# Altium schematic sheet Sheet1.SchDoc
size A4
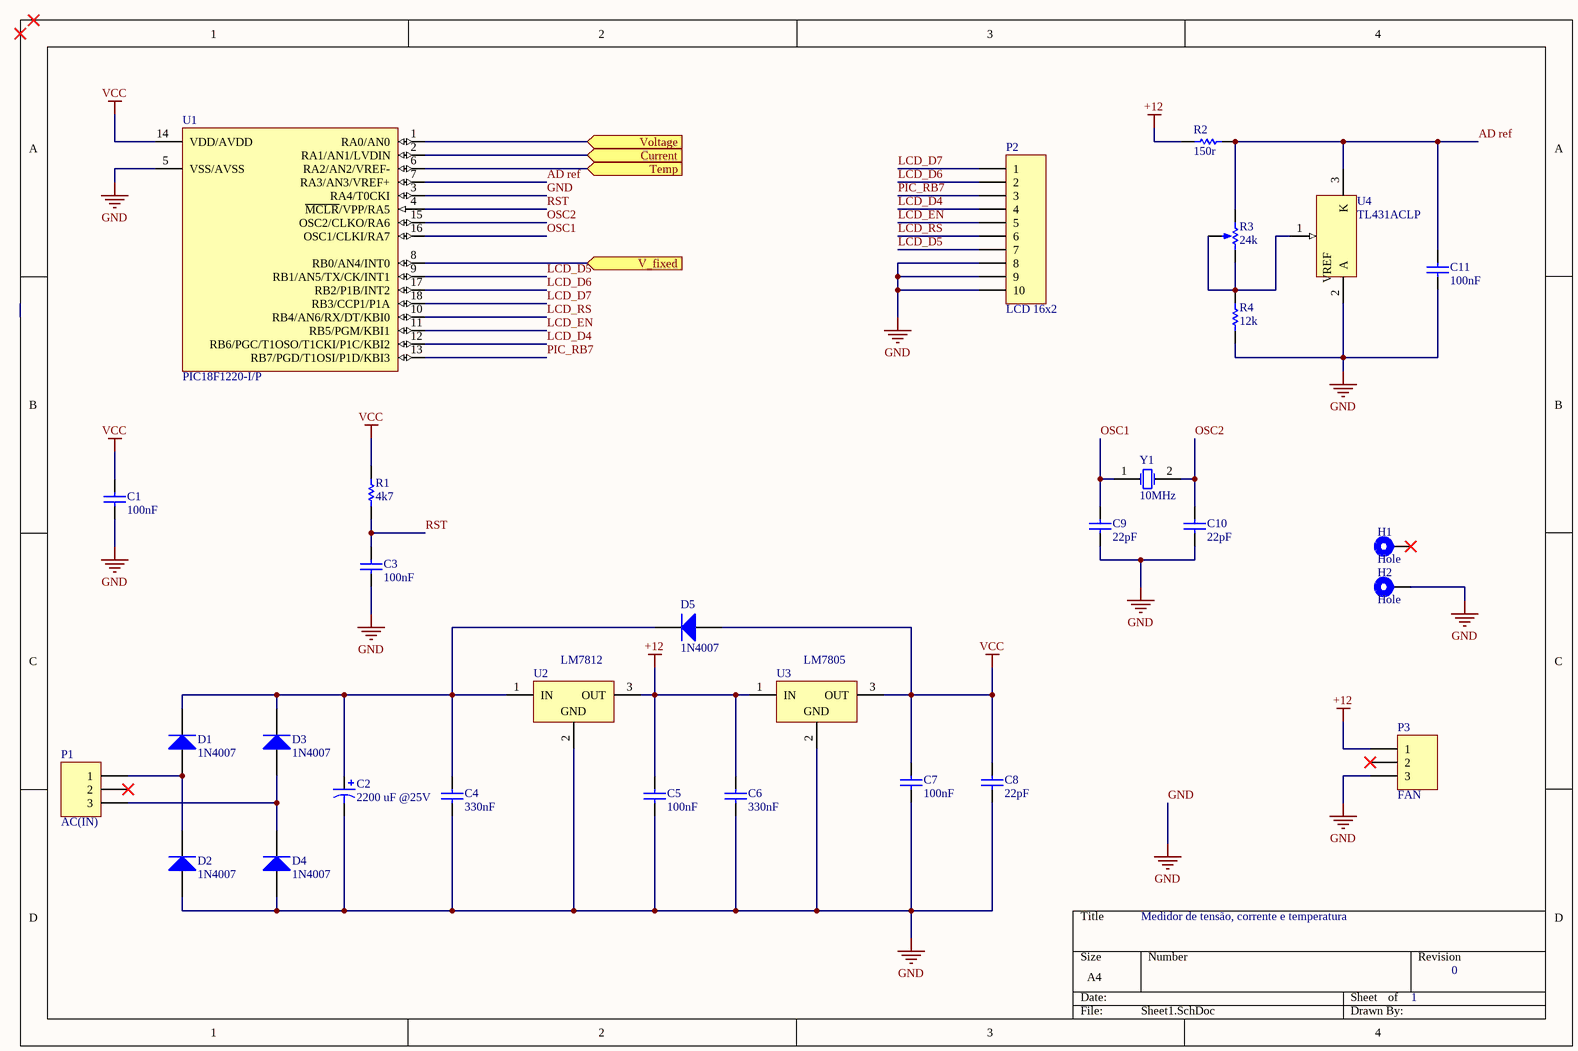
[diagram p0: Sheet1.SchDoc]

## Parts
C1  100nF  [RAD-0.2]
C2  2200 uF @25V  [CAPPR5-13x21]
C3  100nF  [RAD-0.2]
C4  330nF  [RAD-0.2]
C5  100nF  [RAD-0.2]
C6  330nF  [RAD-0.2]
C7  100nF  [RAD-0.2]
C8  22pF  [RAD-0.2]
C9  22pF  [RAD-0.2]
C10  22pF  [RAD-0.2]
C11  100nF  [RAD-0.2]
D1  1N4007  [DIODE-1N400X]
D2  1N4007  [DIODE-1N400X]
D3  1N4007  [DIODE-1N400X]
D4  1N4007  [DIODE-1N400X]
D5  1N4007  [DO-41]
H1  Hole  [HOLE_M3]
H2  Hole  [HOLE_M3]
P1  AC(IN)  [HDR1X3]
P2  LCD 16x2  [HDR1X10]
P3  FAN  [HDR1X3]
R1  4k7  [AXIAL-0.4]
R2  150r  [AXIAL-0.4]
R3  24k  [VR1]
R4  12k  [AXIAL-0.4]
U1  PIC18F1220-I/P  [PDIP300-P18]
U2  LM7812  [T03B]
U3  LM7805  [T03B]
U4  TL431ACLP  [LP03]
Y1  10MHz  [CRYSTAL-HC49S]

## Ports
Current (in), Temp (in), V_fixed (in), Voltage (in)

## Nets
+12: C5.1 C6.1 P3.1 R2.1 U2.3(OUT) U3.1(IN)
GND: C1.2 C2.2 C3.2 C4.2 C5.2 C6.2 C7.2 C8.1 C9.1 C10.1 C11.2 D2.1(A) D4.1(A) H2.1 P2.8 P2.9 P2.10 P3.3 R4.1 U1.3(RA4/T0CKI) U1.5(VSS/AVSS) U2.2(GND) U3.2(GND) U4.2(A)
VCC: C1.1 C7.1 C8.2 D5.1(A) R1.2 U1.14(VDD/AVDD) U3.3(OUT)
AD ref: C11.1 R2.2 R3.1(TOP) U1.7(RA3/AN3/VREF+) U4.3(K)
Current: U1.2(RA1/AN1/LVDIN) ; port Current
LCD_D4: P2.4 U1.12(RB6/PGC/T1OSO/T1CKI/P1C/KBI2)
LCD_D5: P2.7 U1.9(RB1/AN5/TX/CK/INT1)
LCD_D6: P2.2 U1.17(RB2/P1B/INT2)
LCD_D7: P2.1 U1.18(RB3/CCP1/P1A)
LCD_EN: P2.5 U1.11(RB5/PGM/KBI1)
LCD_RS: P2.6 U1.10(RB4/AN6/RX/DT/KBI0)
OSC1: C9.2 U1.16(OSC1/CLKI/RA7) Y1.1(OSC1)
OSC2: C10.2 U1.15(OSC2/CLKO/RA6) Y1.2(OSC2)
PIC_RB7: P2.3 U1.13(RB7/PGD/T1OSI/P1D/KBI3)
RST: C3.1 R1.1 U1.4(~{MCLR}/VPP/RA5)
Temp: U1.6(RA2/AN2/VREF-) ; port Temp
V_fixed: U1.8(RB0/AN4/INT0) ; port V_fixed
Voltage: U1.1(RA0/AN0) ; port Voltage
NetC2_1: C2.1 C4.1 D1.2(K) D3.2(K) D5.2(K) U2.1(IN)
NetD1_1: D1.1(A) D2.2(K) P1.1
NetD3_1: D3.1(A) D4.2(K) P1.3
NetR3_2: R3.2(BOT) R3.3(TAP) R4.2 U4.1(VREF)

Not connected (* = marked no-connect by the designer): H1 1*; P1 2*; P3 2*

## Notes on the sheet
- Medidor de tensão, corrente e temperatura
- 1
- 0

## Library data of the parts
C1 C3-C11 = C: Capacitor; Value: 1; Manufacturer: *; PartNumber: *; Package Type: *
C2 = CP: Polarized Capacitor; Manufacturer: *; PartNumber: *; Package Type: *; Value: *
D1-D4 = D: Diode; Manufacturer: *; PartNumber: *; Package Type: *
D5 = Diode 1N4007: 1 Amp General Purpose Rectifier; Published: 8-Jun-2000; LatestRevisionDate: 17-Jul-2002; LatestRevisionNote: Re-released for DXP Platform.; DatasheetVersion: 1998; PackageVersion: Aug-1999; PackageReference: DO-41; Publisher: Altium Limited; PackageDescription: Diode, Axial; Body 5.2 x 2.7 mm (LxDia. max), Lead Dia. 0.86 mm (max); Code_JEDEC: DO-204-AL; ComponentLink1Description: Manufacturer Link; ComponentLink1URL: http://www.fairchildsemi.com/; ComponentLink2Description: Datasheet; ComponentLink2URL: http://www.fairchildsemi.com/ds/1N%2F1N4001.pdf
P1 P3 = Header 3: Header, 3-Pin; LatestRevisionDate: 17-Jul-2002; LatestRevisionNote: Re-released for DXP Platform.; Publisher: Altium Limited
P2 = Header 10: Header, 10-Pin; LatestRevisionDate: 17-Jul-2002; LatestRevisionNote: Re-released for DXP Platform.; Publisher: Altium Limited
R1 R2 R4 = R: Resistor; Value: 0; Manufacturer: *; PartNumber: *; Package Type: *
R3 = R Pot: Potentiometer; Manufacturer: *; PartNumber: *; Package Type: *; Value: *; Set Position: *
U1 = PIC18F1220-I/P: High Performance, Enhanced Flash Microcontroller with 10-Bit A/D and nanoWatt Technology, 4K Flash, 18-Pin PDIP, Industrial Temperature; Published: 11-Oct-2004; LatestRevisionDate: 29-Jan-2009; LatestRevisionNote: Sch. layout revised. 3D Model Removed.; DatasheetVersion: revF, Feb-2007; PackageVersion: revBB, Aug-2009; PackageReference: PDIP300-P18; Publisher: Altium Limited; PackageDescription: 18-Lead Plastic Dual In-Line (P) - 300 mil Body [PDIP]; Supplier 1: Digi-Key; Supplier Part Number 1: PIC18F1220-I/P-ND; Supplier 2: Farnell; Supplier Part Number 2: 9761977; Supplier 3: Farnell; Supplier Part Number 3: 9771450; Code_JEDEC: MS-001; ComponentLink1Description: Datasheet; ComponentLink1URL: http://ww1.microchip.com/downloads/en/DeviceDoc/39605F.pdf; ComponentLink2Description: Packaging Specification; ComponentLink2URL: http://www.microchip.com/stellent/groups/techpub_sg/documents/packagingspec/en012702.pdf; ComponentLink3Description: Microchip.com Home; ComponentLink3URL: http://www.microchip.com/
U2 U3 = LM7808CT: Series 3-Terminal Positive Regulators, 3-pin TO-220; Manufacturer: National Semiconductor; PackageTopMarking: NSUZXYTTE#*LM7808CT; CompType: LDO IC; Published: 4-Dec-2008; DatasheetVersion: Jul-2006; PackageVersion: revL, Jan-1992; PackageReference: T03B; Publisher: Altium Limited; PackageDescription: TO-220, Molded, 3 Lead, Straight; Supplier 1: Farnell; Supplier Part Number 1: 9490248; PartNumber: LM7808CT; RoHS: O; PinCount: 3; ComponentLink1Description: LM340 Datasheet; ComponentLink1URL: http://www.national.com/ds/LM/LM340.pdf; ComponentLink2Description: LM340 Web Page; ComponentLink2URL: http://www.national.com/pf/LM/LM340.html; ComponentLink3Description: T03B Package Page; ComponentLink3URL: http://www.national.com/packaging/folders/t03b.html
U4 = TL431ACLP: Adjustable Precision Shunt Regulator; Published: 15-Apr-2002; LatestRevisionDate: 06-Jun-2005; LatestRevisionNote: Sch pins 1 & 3 swapped; DatasheetVersion: Oct-2000; PackageVersion: Nov-2001; PackageReference: LP03; Publisher: Altium Limited; PackageDescription: TO, Flat Index; 3 In-Line, Axial Leads; Body Dia. 4.8mm; Leads 0.56 x 0.41 mm (max); Code_JEDEC: TO-226-AA; ComponentLink1Description: Manufacturer Link; ComponentLink1URL: http://www.ti.com/; ComponentLink2Description: Datasheet; ComponentLink2URL: http://www-s.ti.com/sc/ds/tl431a.pdf
Y1 = XTAL: Crystal Oscillator; Manufacturer: *; PartNumber: *; Package Type: *